# EAGLE design left (EAGLE 6.1)
APVD: B.F; DOC_ID: CLK-SCH-04; DOC_PART_NO: CLK-PC-04; DOC_REV: A; DOC_TITLE: Left panel; PROJECT_NAME: Alarm Clock
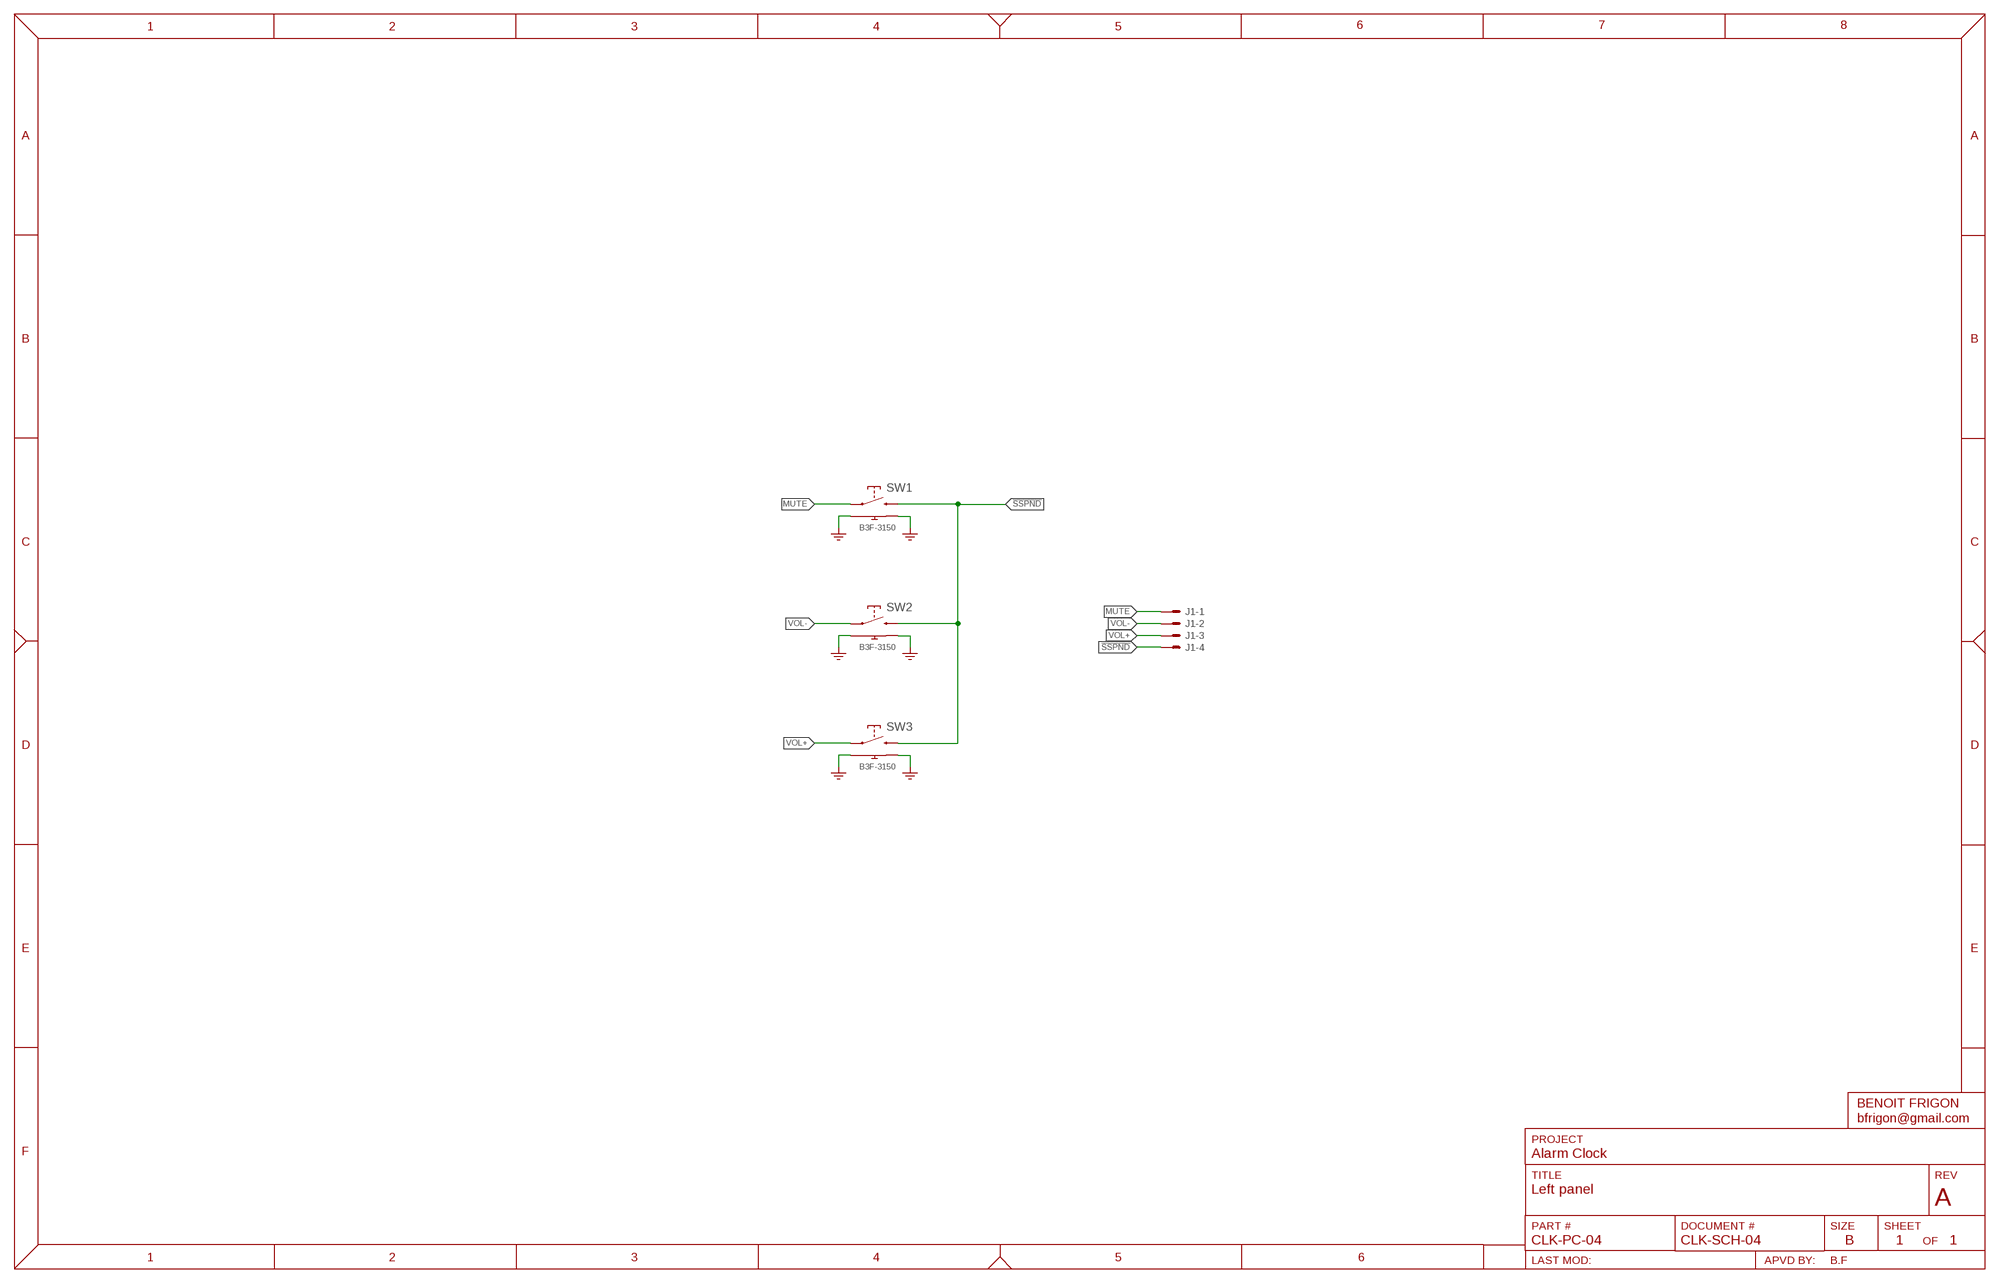
[diagram p0: schematic, sheet 1]

## Parts
J1  SNG-2MM-HEADER-04-V  [DF3X-4P-2DSA]
SW1  B3F-3150  [B3F-315X]
SW2  B3F-3150  [B3F-315X]
SW3  B3F-3150  [B3F-315X]

## Nets
!SSPND: J1.4 SW1.2 SW2.2 SW3.2
GND: SW1.3 SW1.4 SW2.3 SW2.4 SW3.3 SW3.4
MUTE: J1.1 SW1.1
VOL+: J1.3 SW3.1
VOL-: J1.2 SW2.1

## Library data of the parts
J1 = Connectors:SNG-2MM-HEADER-04: 2mm Single Row Header - 4 pos; DESCRIPTION: {DESCRIPTION} - Vertical; MFG: Hirose Electronic; SKU: DF3A-4P-2DSA
SW1 SW3 = Switch:B3F-315?: Tactile switch - 6mm - Vertical; MFG: Omron; PRICE: 0.21
SW2 = Switch:B3F-315?: Tactile switch - 6mm - Vertical; MFG: Omron; PRICE: 0.21; TEST: test

## Board
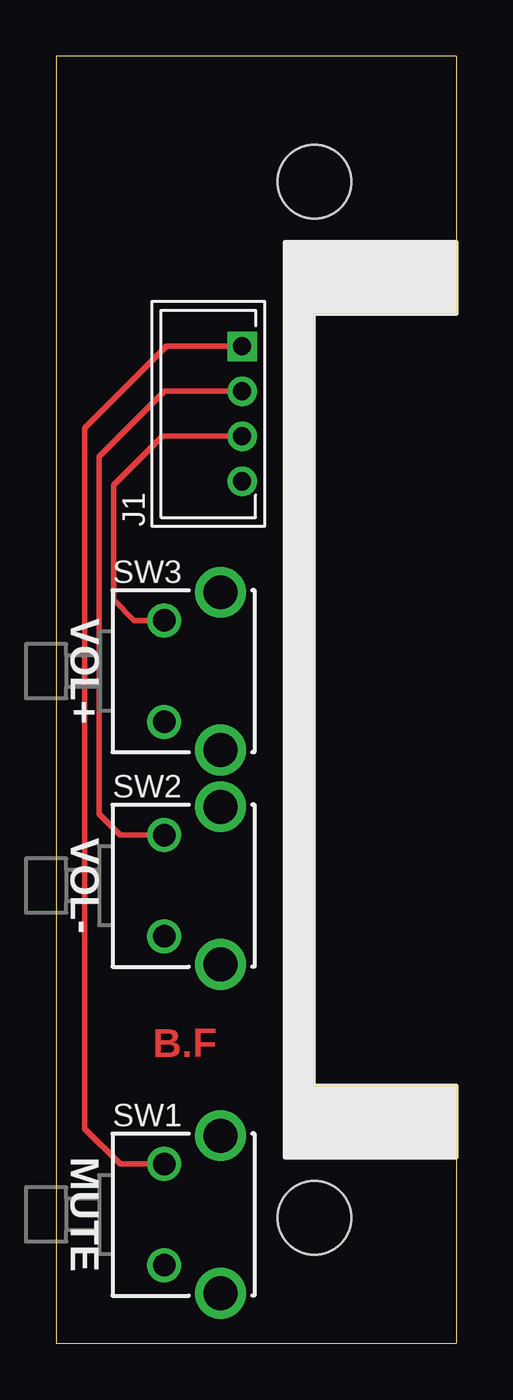
[diagram p1: board, top side]
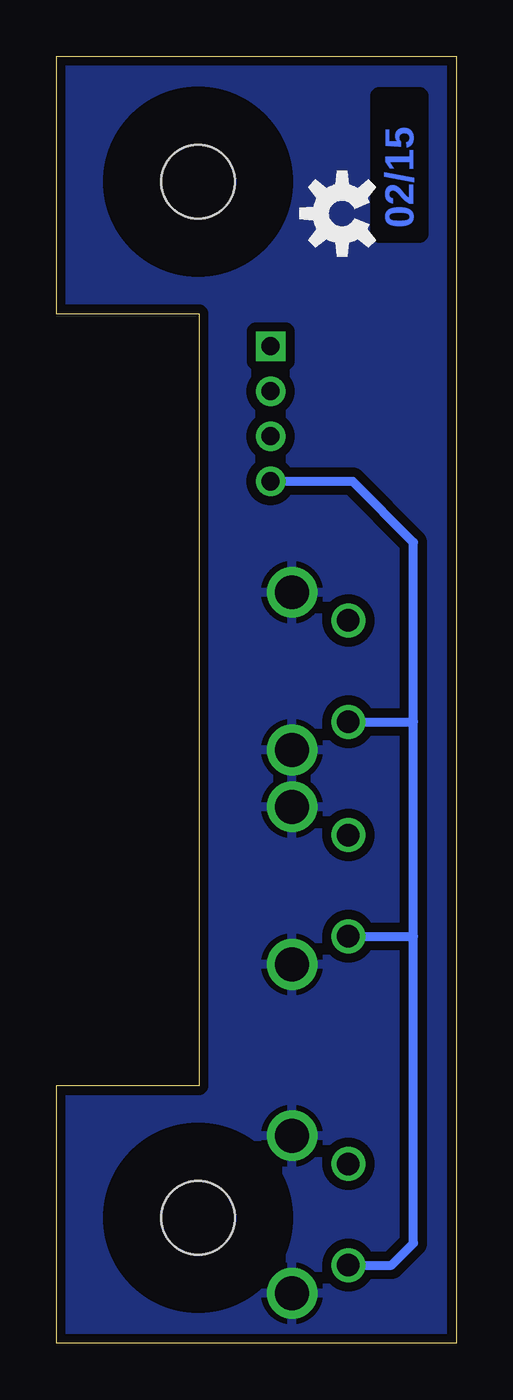
[diagram p2: board, bottom side, seen from below]

Size 17.78 x 57.15 mm. Coordinates in mm from the lower left corner, seen from the top.
Outline: 0,0 17.78,0 17.78,11.43 11.43,11.43 11.43,45.72 17.78,45.72 17.78,57.15 0,57.15 0,0
Copper layers (1*16): Top 0.035mm / dielectric 1.5mm / Bottom 0.035mm
Design rules: minimum track width 8mil, minimum drill 18mil, track to track 8mil, track to pad 8mil, pad to pad 8mil, via to via 8mil, smd to smd 8mil, copper to edge 16mil, drill to drill 8mil, minimum pad ring 10mil, minimum via ring 8mil, stop-mask expansion 4mil, vias tented up to drill 24mil, thermal gap 10mil
Holes 3.28 mm at 11.48,5.56 11.48,51.59
tKeepout: area 11.4,45.7 to 17.8,48.9; area 11.4,8.3 to 17.8,11.4; area 10.2,8.3 to 11.4,48.9
tRestrict: area 7.7,1.8 to 15.3,9.4; area 7.7,47.8 to 15.3,55.4
bRestrict: area 7.7,1.8 to 15.3,9.4; area 7.7,47.8 to 15.3,55.4

### Footprints (pad centres in the part's own frame; a part is rotated, then mirrored left to right if it is on the bottom)
DF3X-4P-2DSA = drill 0.8 square: 1 3,0 | drill 0.8: 2 1,0; 3 -1,0; 4 -3,0
B3F-315X = drill 1: 1 -2.25,0; 2 2.25,0 | drill 1.5: 3 -3.5,2.5; 4 3.5,2.5

### Placement (x,y rotation side)
J1  8.26,41.27 90 top
SW1  4.8,5.71 270 top
SW2  4.8,20.32 270 top
SW3  4.8,29.84 270 top
U$1  [INFO_AUTHOR]  5.71,13.34 0 top
U$2  [INFO_DATE]  1.91,49.53 90 bottom
U$3  [OPENHW_LOGO_150]  5.08,50.16 90 bottom

### Tracks (layer width: path | path; a pad name or v marks a point on that pad's centre or on a via)
!SSPND
  Bottom 0.406: SW1.2 2.88,3.46 1.91,4.45 1.91,18.07 | 1.91,18.07 1.91,27.59 | 1.91,27.59 1.91,35.56 4.62,38.27 J1.4 | SW3.2 1.91,27.59 | SW2.2 1.91,18.07
GND
  pour Bottom (isolate 0.406): 18.41,-0.64 -0.64,-0.64 -0.64,57.78 18.41,57.78
MUTE
  Top 0.254: SW1.1 2.83,7.96 1.27,9.53 1.27,40.64 4.91,44.27 J1.1
VOL+
  Top 0.254: SW3.1 3.46,32.09 2.54,33.02 2.54,38.1 4.71,40.27 J1.3
VOL-
  Top 0.254: SW2.1 2.83,22.57 1.91,23.5 1.91,39.37 4.81,42.27 J1.2

### Text on the board
tPlace: VOL+ | VOL- | MUTE
_tsilk: J1 | SW3 | VOL+ | SW2 | VOL- | SW1 | MUTE